# Altium schematic sheet RcMPPT-IO.SchDoc: RcMPPT-IO
size A4; Author: Thomas Hofmann; CompanyName: HTL St. Pölten; Organization: Altium Limited; Address1: RcMPPT; Address2: Frenchs Forest; Address3: NSW; Address4: Australia 2086; DocumentNumber: 5; Revision: 2.0; SheetNumber: 5; SheetTotal: 8
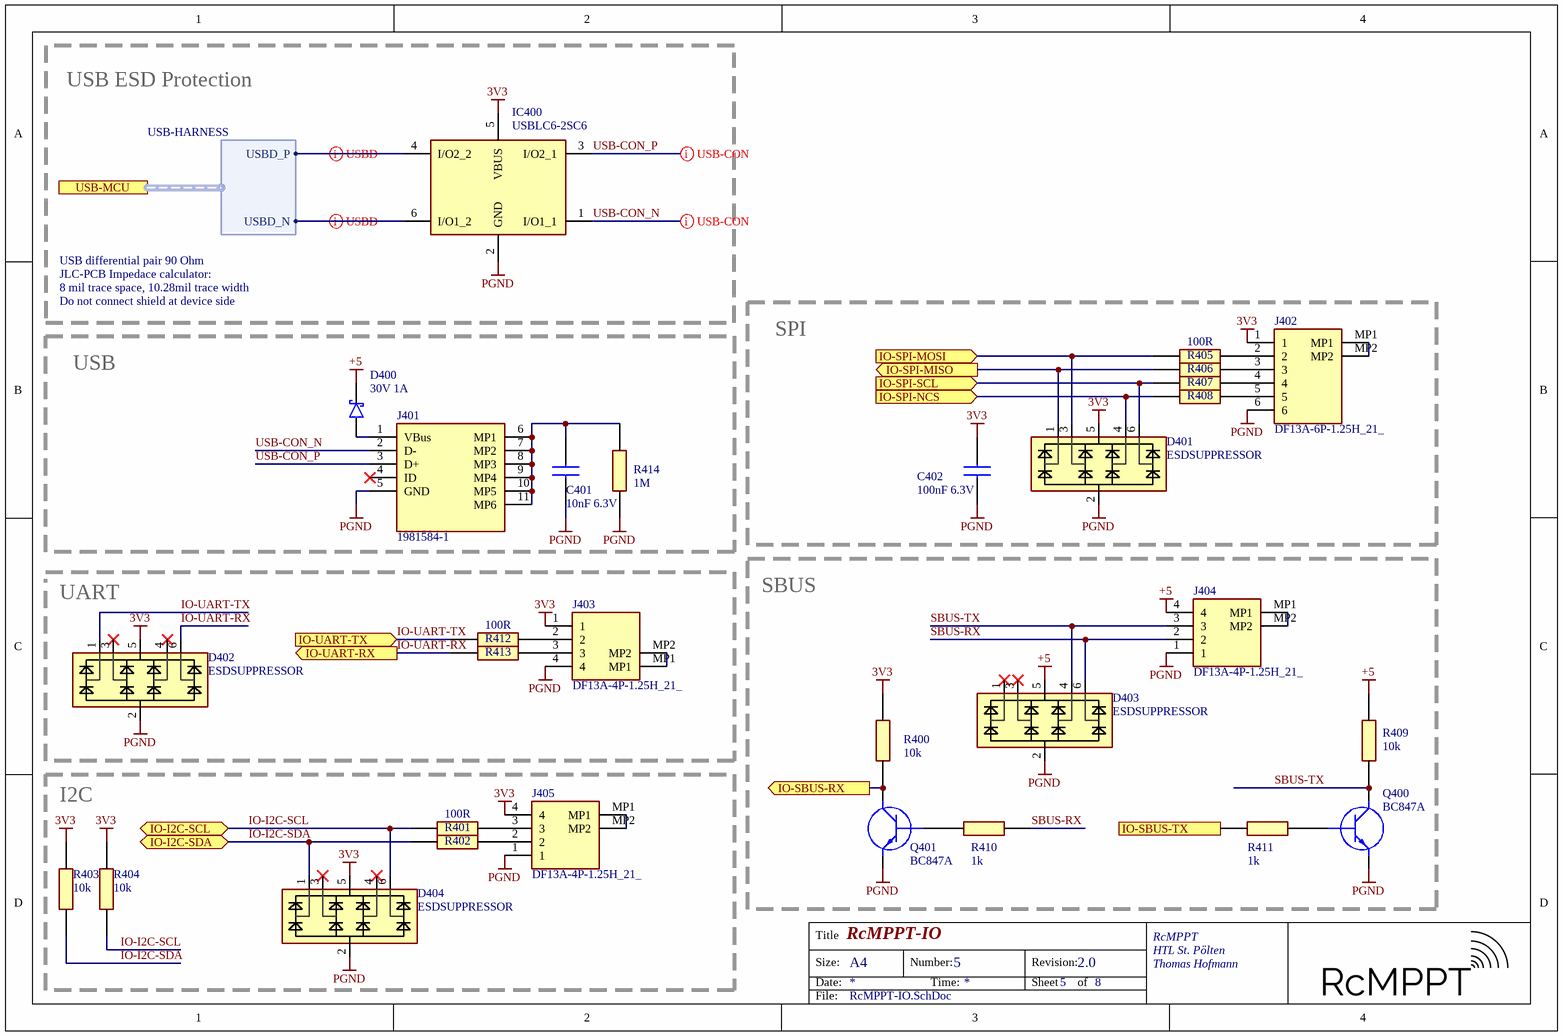
[diagram p0: RcMPPT-IO.SchDoc]

## Parts
C401  10nF 6.3V  [CAPC1608X97N]
C402  100nF 6.3V  [CAPC1608X97N]
D400  30V 1A  [SOD-323]
D401  ESDSUPPRESSOR  [SOT23-6]
D402  ESDSUPPRESSOR  [SOT23-6]
D403  ESDSUPPRESSOR  [SOT23-6]
D404  ESDSUPPRESSOR  [SOT23-6]
IC400  USBLC6-2SC6  [SOT95P280X145-6N]
J401  1981584-1  [19815841]
J402  DF13A-6P-1.25H_21_  [DF13A6P125H21]
J403  DF13A-4P-1.25H_21_  [DF13A4P125H21]
J404  DF13A-4P-1.25H_21_  [DF13A4P125H21]
J405  DF13A-4P-1.25H_21_  [DF13A4P125H21]
Q400  BC847A  [SOT95P230X110-3N]
Q401  BC847A  [SOT95P230X110-3N]
R400  10k  [RESC1608X50N]
R401  100R  [RESC1005X40N]
R402  100R  [RESC1005X40N]  (value not drawn)
R403  10k  [RESC1608X50N]
R404  10k  [RESC1608X50N]
R405  100R  [RESC1005X40N]
R406  100R  [RESC1005X40N]  (value not drawn)
R407  100R  [RESC1005X40N]  (value not drawn)
R408  100R  [RESC1005X40N]  (value not drawn)
R409  10k  [RESC1608X50N]
R410  1k  [RESC1608X50N]
R411  1k  [RESC1608X50N]
R412  100R  [RESC1005X40N]
R413  100R  [RESC1005X40N]  (value not drawn)
R414  1M  [RESC1608X50N]

## Blocks framed on the sheet
SPI: C402 D401 J402 R405-R408
USB: C401 D400 J401 R414
SBUS: D403 J404 Q400 Q401 R400 R409-R411
I2C: D404 J405 R401-R404

## Ports
IO-I2C-SCL (bidir), IO-I2C-SDA (bidir), IO-SBUS-RX (out), IO-SBUS-TX (in), IO-SPI-MISO (out), IO-SPI-MOSI (in), IO-SPI-NCS (in), IO-SPI-SCL (in), IO-UART-RX (out), IO-UART-TX (in), USB-MCU (harness USB-HARNESS)

## Harnesses
USB-HARNESS: USBD_P, USBD_N

## Nets
3V3: C402.2 D401.5(VDD) D402.5(VDD) D404.5(VDD) IC400.5(VBUS) J402.1 J403.1 J405.4 R400.2 R403.1 R404.1
+5: D400.1(K) D403.5(VDD) J404.4 R409.2
PGND: C401.1 C402.1 D401.2(GND) D402.2(GND) D403.2(GND) D404.2(GND) IC400.2(GND) J401.5(GND) J402.6 J403.4 J404.1 J405.1 Q400.2(E) Q401.2(E) R414.1
IO-I2C-SCL: D404.6(CH4) R401.1 R404.2 ; port IO-I2C-SCL
IO-I2C-SDA: D404.1(CH1) R402.1 R403.2 ; port IO-I2C-SDA
IO-SBUS-RX: Q401.3(C) R400.1 ; port IO-SBUS-RX
IO-SBUS-TX: R411.2 ; port IO-SBUS-TX
IO-SPI-MISO: D401.1(CH1) R406.1 ; port IO-SPI-MISO
IO-SPI-MOSI: D401.3(CH2) R405.1 ; port IO-SPI-MOSI
IO-SPI-NCS: D401.4(CH3) R408.1 ; port IO-SPI-NCS
IO-SPI-SCL: D401.6(CH4) R407.1 ; port IO-SPI-SCL
IO-UART-RX: D402.6(CH4) R413.1 ; port IO-UART-RX
IO-UART-TX: D402.1(CH1) R412.1 ; port IO-UART-TX
SBUS-RX: D403.6(CH4) J404.2 R410.2
SBUS-TX: D403.4(CH3) J404.3 Q400.3(C) R409.1
USB-CON_N: IC400.1(I/O1_1) J401.2(D-)
USB-CON_P: IC400.3(I/O2_1) J401.3(D+)
NetC401_2: C401.2 J401.6(MP1) J401.7(MP2) J401.8(MP3) J401.9(MP4) J401.10(MP5) J401.11(MP6) R414.2
NetD400_2: D400.2(A) J401.1(VBus)
NetIC400_4: IC400.4(I/O2_2) ; port USB-MCU.USBD_P
NetIC400_6: IC400.6(I/O1_2) ; port USB-MCU.USBD_N
NetJ402_2: J402.2 R405.2
NetJ402_3: J402.3 R406.2
NetJ402_4: J402.4 R407.2
NetJ402_5: J402.5 R408.2
NetJ402_MP1: J402.MP1 J402.MP2
NetJ403_2: J403.2 R412.2
NetJ403_3: J403.3 R413.2
NetJ403_MP1: J403.MP1 J403.MP2
NetJ404_MP1: J404.MP1 J404.MP2
NetJ405_2: J405.2 R402.2
NetJ405_3: J405.3 R401.2
NetJ405_MP1: J405.MP1 J405.MP2
NetQ400_1: Q400.1(B) R411.1
NetQ401_1: Q401.1(B) R410.1

Not connected (* = marked no-connect by the designer): D402 3(CH2)* 4(CH3)*; D403 1(CH1)* 3(CH2)*; D404 3(CH2)* 4(CH3)*; J401 4(ID)*

## Layout directives
differential pair: NetIC400_4, NetIC400_6, USB-CON_N, USB-CON_P

## Notes on the sheet
- USB ESD Protection
- USB differential pair 90 Ohm
- JLC-PCB Impedace calculator:
- Do not connect shield at device side
- 8 mil trace space, 10.28mil trace width
- (near D402) UART
- Title
- Size:
- Date:
- A4
- Number:
- Time:
- Revision:
- Sheet
- of
- RcMPPT
- File:

## Library data of the parts
C401 C402 = C0603: Capacitor; Height: 0.97
D400 = SCHOTTKY-DIODE: Schottky Diode
D401-D404 = ESDSUPPRESSOR: TVS Diode Array; Height: 0.6mm
IC400 = USBLC6-2SC6: Integrated Circuit; Manufacturer_Name: STMicroelectronics; Datasheet Link: http://www.st.com/st-web-ui/static/active/en/resource/technical/document/datasheet/CD00050750.pdf; Height: 1.45mm; Manufacturer_Part_Number: USBLC6-2SC6; Arrow Part Number: USBLC6-2SC6; Arrow Price/Stock: https://www.arrow.com/en/products/usblc6-2sc6/stmicroelectronics; Mouser Part Number: 511-USBLC6-2SC6; Mouser Price/Stock: https://www.mouser.co.uk/ProductDetail/STMicroelectronics/USBLC6-2SC6?qs=po45yt2pPpu%2FhNIlwQdTlg%3D%3D
J401 = 1981584-1: Connector; Manufacturer_Name: TE Connectivity; Datasheet Link: http://www.te.com/commerce/DocumentDelivery/DDEController?Action=showdoc&DocId=Customer+Drawing%7F1981584%7FD2%7Fpdf%7FEnglish%7FENG_CD_1981584_D2.pdf%7F1981584-1; Height: 3mm; Manufacturer_Part_Number: 1981584-1; Arrow Part Number: 1981584-1; Arrow Price/Stock: https://www.arrow.com/en/products/1981584-1/te-connectivity; Mouser Part Number: 571-1981584-1; Mouser Price/Stock: https://www.mouser.co.uk/ProductDetail/TE-Connectivity/1981584-1?qs=ozkTL%2FUej0TLYxjQLPnd2Q%3D%3D
J402 = DF13A-6P-1.25H_21_: Connector; Manufacturer_Name: Hirose; Manufacturer_Part_Number: DF13A-6P-1.25H(21); Datasheet Link: https://www.hirose.com/product/download/?distributor=digikey&type=2d&lang=en&num=DF13A-6P-1.25H(21); Height: 3.75mm; Mouser Part Number: 798-DF13A6P125H21; Mouser Price/Stock: https://www.mouser.co.uk/ProductDetail/Hirose-Connector/DF13A-6P-125H21?qs=XQjbzJWzFPXnreVi%252BPl0Lg%3D%3D; Arrow Part Number: DF13A-6P-1.25H(21); Arrow Price/Stock: https://www.arrow.com/en/products/df13a-6p-1.25h-21/hirose-electric
J403-J405 = DF13A-4P-1.25H_21_: Connector; Manufacturer_Name: Hirose; Manufacturer_Part_Number: DF13A-4P-1.25H(21); Datasheet Link: https://componentsearchengine.com/Datasheets/1/DF13A-4P-1.25H(21).pdf; Height: 3.6mm; Mouser Part Number: 798-DF13A4P125H21; Mouser Price/Stock: https://www.mouser.co.uk/ProductDetail/Hirose-Connector/DF13A-4P-125H21?qs=XQjbzJWzFPXWzMShI70F0w%3D%3D
Q400 Q401 = BC847A,235: Transistor BJT NPN; Manufacturer_Name: Nexperia; Datasheet Link: http://assets.nexperia.com/documents/data-sheet/BC847_SER.pdf; Height: 1.1mm; Manufacturer_Part_Number: BC847A,235; Mouser Part Number: 771-BC847A235; Mouser Price/Stock: https://www.mouser.co.uk/ProductDetail/Nexperia/BC847A235?qs=me8TqzrmIYWeD%252BqPzufrRA%3D%3D; Arrow Part Number: BC847A,235; Arrow Price/Stock: https://www.arrow.com/en/products/bc847a235/nexperia
R400 R403 R404 R409-R411 R414 = R0603: Resistor; Height: 0.55mm
R401 R402 R405-R408 R412 R413 = R0402: Resistor; Height: 0.4mm